# EAGLE schematic 8steps (EAGLE 7.4.0)
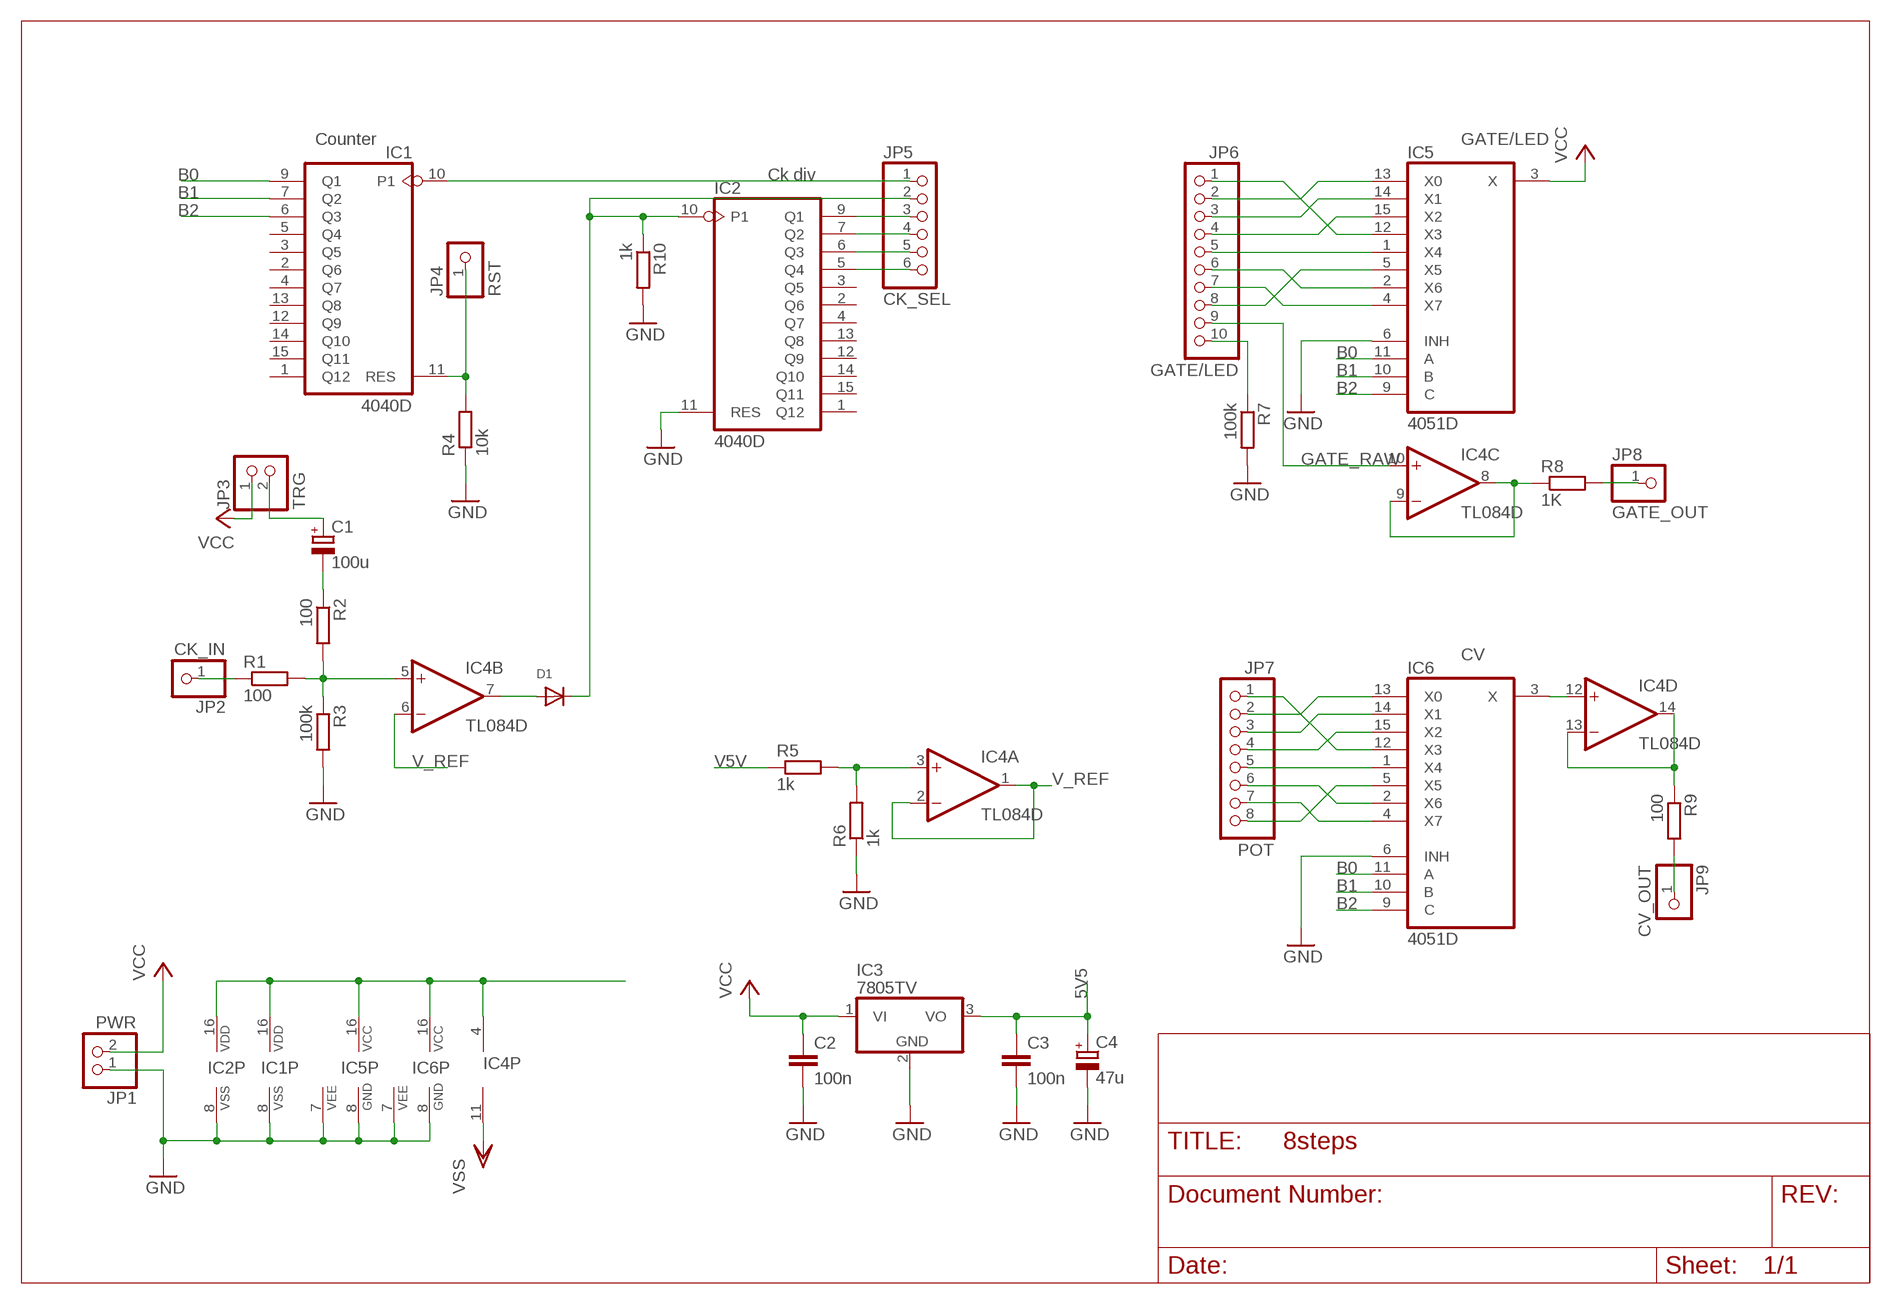
[diagram p0: schematic, sheet 1]

## Parts
C1  100u  CPOL-EUE2.5-7  [E2,5-7]
C2  100n  C-EU050-025X075  [C050-025X075]
C3  100n  C-EU050-025X075  [C050-025X075]
C4  47u  CPOL-EUE2.5-7  [E2,5-7]
D1  DIODESOT23_WAVE  [SOT23-W]
IC1  4040D  [SO16]
IC2  4040D  [SO16]
IC3  7805TV  [TO220V]
IC4  TL084D  [SO14]
IC5  4051D  [SO16]
IC6  4051D  [SO16]
JP1  PWR  PINHD-1X2  [1X02]
JP2  CK_IN  PINHD-1X1  [1X01]
JP3  TRG  PINHD-1X2  [1X02]
JP4  RST  PINHD-1X1  [1X01]
JP5  CK_SEL  PINHD-1X6  [1X06]
JP6  GATE/LED  PINHD-1X10  [1X10]
JP7  POT  PINHD-1X8  [1X08]
JP8  GATE_OUT  PINHD-1X1  [1X01]
JP9  CV_OUT  PINHD-1X1  [1X01]
R1  100  R-EU_R0805  [R0805]
R2  100  R-EU_R0805  [R0805]
R3  100k  R-EU_R0805  [R0805]
R4  10k  R-EU_R0805  [R0805]
R5  1k  R-EU_R0805  [R0805]
R6  1k  R-EU_R0805  [R0805]
R7  100k  R-EU_R0805  [R0805]
R8  1K  R-EU_R0805  [R0805]
R9  100  R-EU_R0805  [R0805]
R10  1k  R-EU_R0805  [R0805]

## Nets
5V5: C3.1 C4.+ IC3.3(VO)
B0: IC1.9(Q1) IC5.11(A) IC6.11(A)
B1: IC1.7(Q2) IC5.10(B) IC6.10(B)
B2: IC1.6(Q3) IC5.9(C) IC6.9(C)
GATE_RAW: IC4.10(C:+IN) JP6.9
GND: C2.2 C3.2 C4.- IC1.8(VSS) IC2.8(VSS) IC2.11(RES) IC3.2(GND) IC5.6(INH) IC5.7(VEE) IC5.8(GND) IC6.6(INH) IC6.7(VEE) IC6.8(GND) JP1.1 R3.2 R4.1 R6.1 R7.2 R10.2
N$1: IC4.3(A:+IN) R5.2 R6.2
N$2: C1.- R2.1
N$3: IC4.12(D:+IN) IC6.3(X)
N$4: D1.3(C) IC2.10(P1) JP5.2 R10.1
N$5: IC2.9(Q1) JP5.3
N$6: IC2.7(Q2) JP5.4
N$7: IC2.6(Q3) JP5.5
N$8: IC2.5(Q4) JP5.6
N$9: IC1.10(P1) JP5.1
N$10: IC5.12(X3) JP6.1
N$11: IC5.13(X0) JP6.2
N$12: IC5.14(X1) JP6.3
N$13: IC5.15(X2) JP6.4
N$14: IC5.1(X4) JP6.5
N$15: IC5.4(X7) JP6.7
N$16: IC5.2(X6) JP6.6
N$17: IC5.5(X5) JP6.8
N$18: IC6.12(X3) JP7.1
N$19: IC6.13(X0) JP7.2
N$20: IC6.14(X1) JP7.3
N$21: IC6.15(X2) JP7.4
N$22: IC6.1(X4) JP7.5
N$23: IC6.4(X7) JP7.7
N$24: D1.1(A) IC4.7(B:OUT)
N$25: IC6.5(X5) JP7.8
N$26: IC4.13(D:-IN) IC4.14(D:OUT) R9.1
N$27: JP9.1 R9.2
N$28: JP6.10 R7.1
N$29: IC1.11(RES) JP4.1 R4.2
N$30: IC4.8(C:OUT) IC4.9(C:-IN) R8.1
N$31: JP8.1 R8.2
N$32: IC6.2(X6) JP7.6
N$33: IC4.5(B:+IN) R1.2 R2.2 R3.1
N$34: C1.+ JP3.2
N$35: JP2.1 R1.1
V5V: IC1.16(VDD) IC2.16(VDD) IC4.4(P:V+) IC5.16(VCC) IC6.16(VCC) R5.1
V_REF: IC4.1(A:OUT) IC4.2(A:-IN) IC4.6(B:-IN)
VCC: C2.1 IC3.1(VI) IC5.3(X) JP1.2 JP3.1
VSS: IC4.11(P:V-)
Unconnected: IC1.1(Q12) IC1.2(Q6) IC1.3(Q5) IC1.4(Q7) IC1.5(Q4) IC1.12(Q9) IC1.13(Q8) IC1.14(Q10) IC1.15(Q11) IC2.1(Q12) IC2.2(Q6) IC2.3(Q5) IC2.4(Q7) IC2.12(Q9) IC2.13(Q8) IC2.14(Q10) IC2.15(Q11)

## Notes on the sheet
- Counter | GATE/LED
- Ck div
- CV

## Library data of the parts
C1 C4 = rcl:CPOL-EU: POLARIZED CAPACITOR, European symbol
C2 C3 = rcl:C-EU: CAPACITOR, European symbol
D1 = adafruit:DIODE: Diode SMADIODE - SMA Surface Mount Package 20V 1A Schottky Diode Digikey: 641-1014-6-ND DO-1N4148 - Through Hole Small Current Diode SOD-123 20V 1 A (.5mV Vf) Schottky Diode - Digikey: MBRX120TPMSCT-ND SOD-323 10V 570mA (.38mV Vf, 3ns) Schottky Diode - Digikey: ZLLS410CT-ND SOD-523 30V 30mA Schottky Diode (RB751S-40TE61) - Digikey: RB751S-40TE61CT-ND SOT23-R/W - SOT23 Package (R = Solder Paste/Reflow Ovens, W = Hand-Soldering) BAT54Film 40V 300mA - Digikey: 497-7162-1-ND
IC1 IC2 = 40xx:4040: 12-stage binary/ripple COUNTER
IC3 = linear:78*: Positive VOLTAGE REGULATOR Source: http://cache.national.com/ds/LM/LM78L05.pdf http://www.fairchildsemi.com/ds/LM/LM7805.pdf
IC4 = linear:TL084: OP AMP
IC5 IC6 = 40xx:4051: 8-channel ANALOG MULTIPLEXER
JP1 JP3 = pinhead:PINHD-1X2: PIN HEADER
JP2 JP4 JP8 JP9 = pinhead:PINHD-1X1: PIN HEADER
JP5 = pinhead:PINHD-1X6: PIN HEADER
JP6 = pinhead:PINHD-1X10: PIN HEADER
JP7 = pinhead:PINHD-1X8: PIN HEADER
R1-R10 = rcl:R-EU_: RESISTOR, European symbol

## Net classes
0 default: clearance 0.205 mm